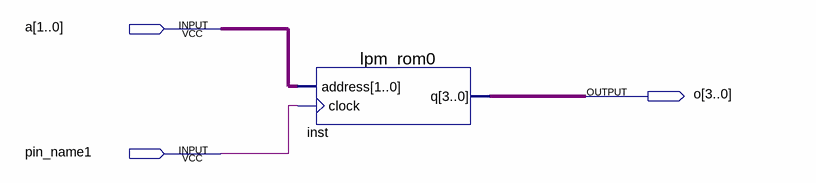
[diagram p0: schematic sheet]
// Quartus schematic project_3.bdf as structural Verilog: 1 symbols, 3 pins
module project_3 (
  input  [1:0] a,
  input  pin_name1,
  output [3:0] o
);

  lpm_rom0 inst (.address(a), .clock(pin_name1), .q(o));
endmodule
